# EAGLE schematic total_universal (EAGLE 9.2.0)
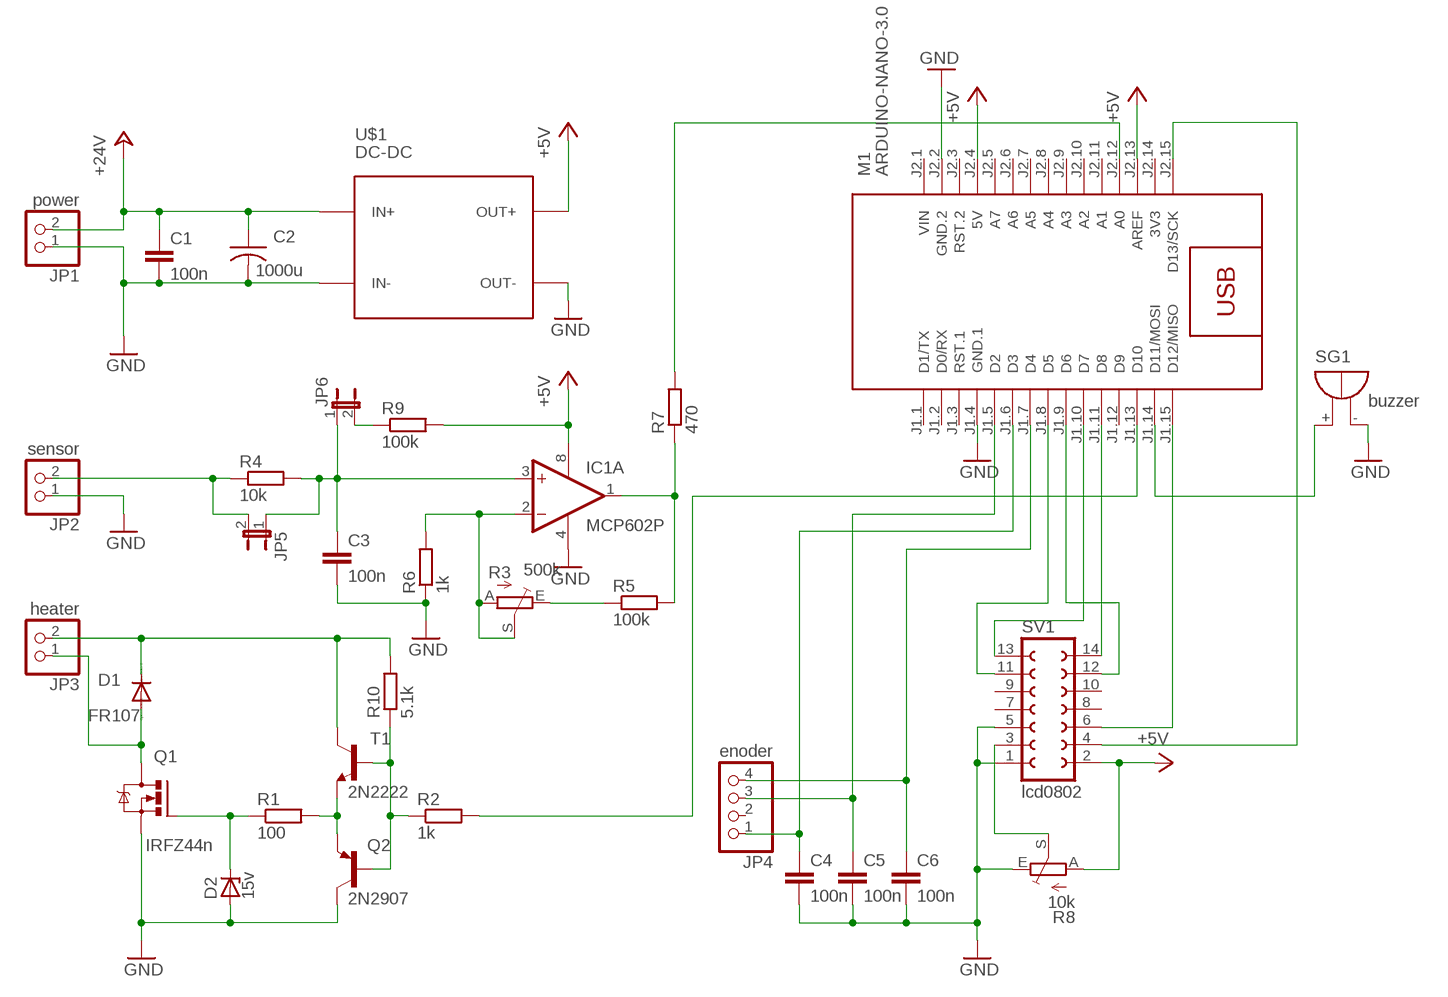
[diagram p0: schematic, sheet 1]

## Parts
C1  100n  C-EU025-025X050  [C025-025X050]
C2  1000u  C-US025-025X050  [C025-025X050]
C3  100n  C-EU025-025X050  [C025-025X050]
C4  100n  C-EU025-025X050  [C025-025X050]
C5  100n  C-EU025-025X050  [C025-025X050]
C6  100n  C-EU025-025X050  [C025-025X050]
D1  FR107  1N4004  [DO41-10]
D2  15v  ZENER-DIODEC1702-15  [C1702-15]
IC1  MCP602P  [DIL08]
JP1  power  PINHD-1X2  [1X02]
JP2  sensor  PINHD-1X2  [1X02]
JP3  heater  PINHD-1X2  [1X02]
JP4  enoder  PINHD-1X4  [1X04]
JP5  JP1E  [JP1]
JP6  JP1E  [JP1]
M1  ARDUINO-NANO-3.0  [ARDUINO-NANO-3.0]
Q1  IRFZ44n  IRLZ44Z  [TO220BH]
Q2  2N2907  2N2905  [TO5]
R1  100  R-EU_0204/5  [0204/5]
R2  1k  R-EU_0204/5  [0204/5]
R3  500k  TRIM_EU-B64Y  [B64Y]
R4  10k  R-EU_0204/5  [0204/5]
R5  100k  R-EU_0204/5  [0204/5]
R6  1k  R-EU_0204/5  [0204/5]
R7  470  R-EU_0204/5  [0204/5]
R8  10k  TRIM_EU-B64Y  [B64Y]
R9  100k  R-EU_0204/5  [0204/5]
R10  5.1k  R-EU_0204/5  [0204/5]
SG1  buzzer  EB2209A  [EB2209A]
SV1  lcd0802  FE07-2  [FE07-2]
T1  2N2222  [TO18]
U$1  DC-DC  DC-DC-STEP-DOWN-LM2596  [DC-DC-STEP-DOWN-LM2596]

## Nets
+5V: IC1.8(P:V+) M1.J2.4(5V) M1.J2.13(AREF) R8.A R9.2 SV1.2 U$1.OUT+
+24V: C1.1 C2.1 JP1.2 U$1.IN+
GND: C1.2 C2.2 C3.2 C4.2 C5.2 C6.2 D2.A IC1.4(P:V-) JP1.1 JP2.1 M1.J1.4(GND.1) M1.J2.2(GND.2) Q1.S Q2.3(C) R6.1 R8.E SG1.- SV1.1 SV1.5 U$1.IN- U$1.OUT-
N$1: D1.C JP3.2 R10.2 T1.3(C)
N$2: D1.A JP3.1 Q1.D
N$3: D2.C Q1.G R1.1
N$4: Q2.1(E) R1.2 T1.1(E)
N$5: C3.1 IC1.3(A:+IN) JP5.1 JP6.1 R4.2
N$6: IC1.2(A:-IN) R3.A R3.S R6.2
N$7: R3.E R5.1
N$8: Q2.2(B) R2.1 R10.1 T1.2(B)
N$9: IC1.1(A:OUT) R5.2 R7.1
N$10: JP2.2 JP5.2 R4.1
N$11: M1.J2.12(A0) R7.2
N$12: M1.J1.13(D10) R2.2
N$13: M1.J1.14(D11/MOSI) SG1.+
N$14: R8.S SV1.3
N$15: M1.J2.15(D13/SCK) SV1.4
N$16: C4.1 JP4.1 M1.J1.6(D3)
N$17: M1.J1.10(D7) SV1.13
N$18: M1.J1.8(D5) SV1.11
N$19: M1.J1.11(D8) SV1.14
N$20: M1.J1.9(D6) SV1.12
N$21: M1.J1.15(D12/MISO) SV1.6
N$22: C5.1 JP4.3 M1.J1.5(D2)
N$23: C6.1 JP4.4 M1.J1.7(D4)
N$24: JP6.2 R9.1
Unconnected: IC1.5(B:+IN) IC1.6(B:-IN) IC1.7(B:OUT) JP4.2 M1.J1.1(D1/TX) M1.J1.2(D0/RX) M1.J1.3(RST.1) M1.J1.12(D9) M1.J2.3(RST.2) M1.J2.5(A7) M1.J2.6(A6) M1.J2.7(A5) M1.J2.8(A4) M1.J2.9(A3) M1.J2.10(A2) M1.J2.11(A1) SV1.7 SV1.8 SV1.9 SV1.10

## Power pins joined to a net without a drawn wire
3V3: M1.J2.14(3V3)
VIN: M1.J2.1(VIN)

## Library data of the parts
C1 C3-C6 = rcl:C-EU: CAPACITOR, European symbol; SPICEPREFIX: C
C2 = rcl:C-US: CAPACITOR, American symbol; SPICEPREFIX: C
D1 = diode:1N4004: DIODE general purpose rectifier, 1 A
D2 = diode:ZENER-DIODE: Z-Diode
IC1 = linear:MCP602: Single Op Amp 2.7V to 6.0V Single Supply CMOS Source: http://ww1.microchip.com/downloads/en/DeviceDoc/21314g.pdf
JP1-JP3 = pinhead:PINHD-1X2: PIN HEADER
JP4 = pinhead:PINHD-1X4: PIN HEADER
JP5 JP6 = jumper:JP1E: JUMPER
M1 = diy-modules:ARDUINO-NANO-3.0: Arduino Nano 3.0 and compatible devices More details available here: https://www.arduino.cc/en/Main/ArduinoBoardNano Click here to find device on ebay.com <http://www.ebay.com/sch/arduino+nano>
Q1 = transistor-power:IRLZ44Z: N-Channel HEXFET® Power MOSFET Logic Level AUTOMOTIVE MOSFET Source: http://www.irf.com/product-info/datasheets/data/irlz44zpbf.pdf
Q2 = transistor-pnp:2N2905: PNP Transistor
R1 R2 R4-R7 R9 R10 = rcl:R-EU_: RESISTOR, European symbol; SPICEPREFIX: R
R3 R8 = pot:TRIM_EU-: POTENTIOMETER
SG1 = buzzer:EB2209A: BUZZER Source: Buerklin; OC_FARNELL: unknown; OC_NEWARK: unknown
SV1 = con-lsta:FE07-2: FEMALE HEADER; OC_FARNELL: unknown; OC_NEWARK: unknown
T1 = transistor-neu-to92:2N2222: NPN TRANSISTOR
U$1 = diy-modules:DC-DC-STEP-DOWN-LM2596: DC/DC Step-Down Regulator based on LM2596-ADJ chip LM2596 datasheet available here: http://www.ti.com/lit/ds/symlink/lm2596.pdf Click here to find device on ebay.com <http://www.ebay.com/sch/lm2596+power+regulator>